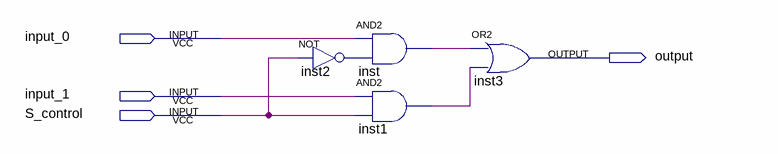
[diagram p0: schematic sheet]
// Quartus schematic MUX.bdf as structural Verilog: 4 symbols, 4 pins
module MUX (
  input  input_0,
  input  input_1,
  input  S_control,
  output \output 
);

  wire inst1_out, inst2_out, inst_out;

  and inst (inst_out, input_0, inst2_out);
  not inst2 (inst2_out, S_control);
  and inst1 (inst1_out, input_1, S_control);
  or inst3 (\output , inst_out, inst1_out);
endmodule
